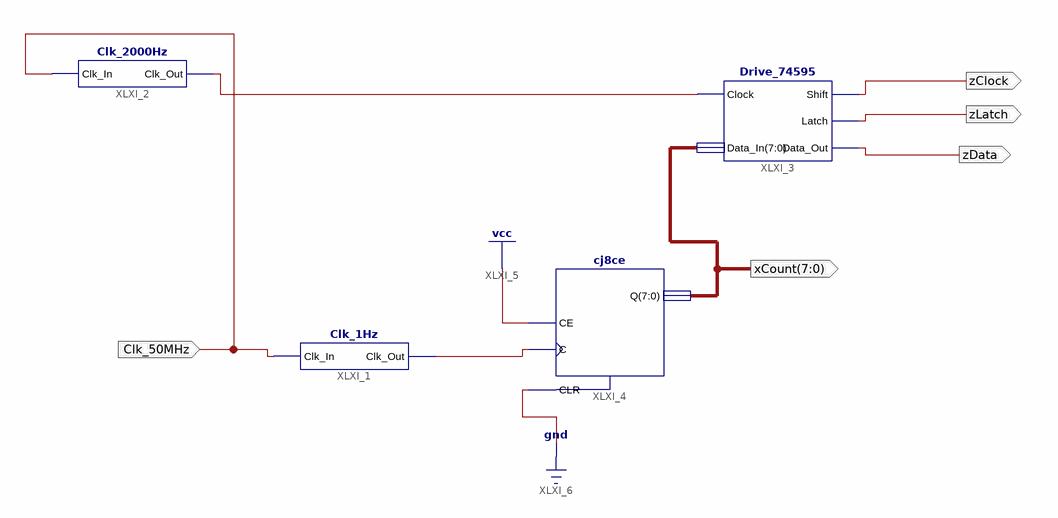
[diagram p0: schematic sheet 1]
// Xilinx ISE schematic assa.sch (spartan6) as structural Verilog: 4 symbols, 5 ports
module assa (
  input  Clk_50MHz,
  output zClock,
  output zLatch,
  output zData,
  output [7:0] xCount
);

  wire XLXN_1, XLXN_2;

  Clk_1Hz XLXI_1 (.Clk_In(Clk_50MHz), .Clk_Out(XLXN_1));
  Clk_2000Hz XLXI_2 (.Clk_In(Clk_50MHz), .Clk_Out(XLXN_2));
  Drive_74595 XLXI_3 (.Clock(XLXN_2), .Data_In(xCount), .Shift(zClock), .Latch(zLatch), .Data_Out(zData));
  cj8ce XLXI_4 (.C(XLXN_1), .CE(1'b1), .CLR(1'b0), .Q(xCount));
endmodule
